# EAGLE design IMU 9DoF Fusion (EAGLE 6.5.0)
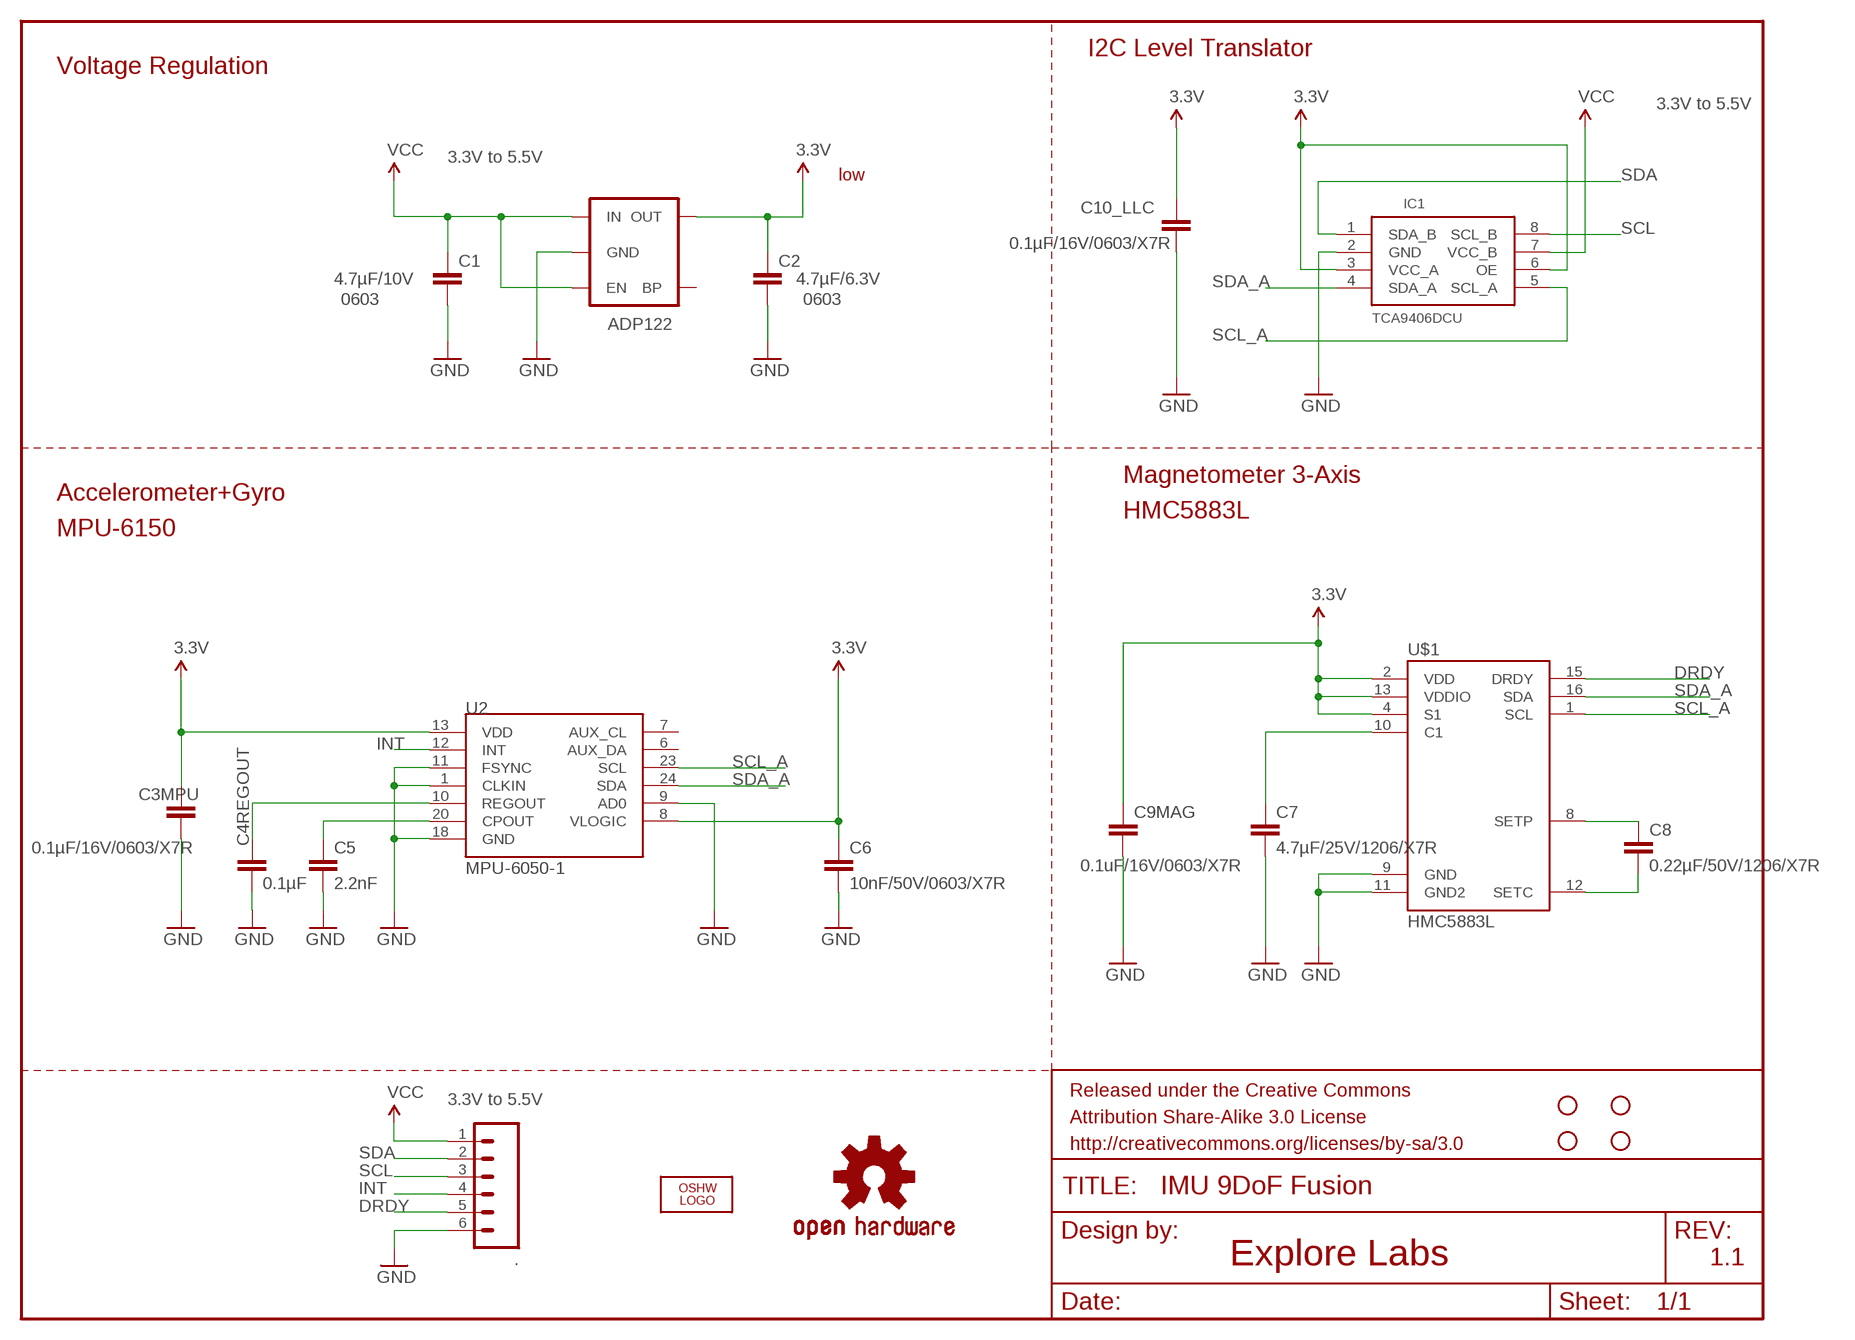
[diagram p0: schematic, sheet 1]

## Parts
.  M06SIP  [1X06]
ADP122  V_REG_LDOSMD  [SOT23-5]
C1  4.7µF/10V  CAP0603-CAP  [0603-CAP]
C2  4.7µF/6.3V  CAP0603-CAP  [0603-CAP]
C3MPU  0.1µF/16V/0603/X7R  CAP0603-CAP  [0603-CAP]
C4REGOUT  0.1µF  CAP0603-CAP  [0603-CAP]
C5  2.2nF  CAP0603-CAP  [0603-CAP]
C6  10nF/50V/0603/X7R  CAP0603-CAP  [0603-CAP]
C7  4.7µF/25V/1206/X7R  CAP1206  [1206]
C8  0.22µF/50V/1206/X7R  CAP1206  [1206]
C9MAG  0.1uF/16V/0603/X7R  CAP0603-CAP  [0603-CAP]
C10_LLC  0.1µF/16V/0603/X7R  CAP0603-CAP  [0603-CAP]
IC1  TCA9406DCU  [VSSOP8]
JP1  STAND-OFFTIGHT  [STAND-OFF-TIGHT]
JP3  STAND-OFFTIGHT  [STAND-OFF-TIGHT]
JP4  STAND-OFFTIGHT  [STAND-OFF-TIGHT]
JP5  STAND-OFFTIGHT  [STAND-OFF-TIGHT]
LOGO1  OSHW_LOGO_FILLX0150-NT  [OSHW_FILLX150_NOTEXT]
U2  MPU-6050-1  [QFN-24-4MM2]
U$1  HMC5883L  [LPCC16]
U$2  OSHW-LOGOS  [OSHW-LOGO-S]

## Nets
3.3V: ADP122.5(OUT) C2.1 C3MPU.1 C6.1 C9MAG.1 C10_LLC.1 IC1.3(VCC_A) IC1.6(OE) U2.8(VLOGIC) U2.13(VDD) U$1.2(VDD) U$1.4(S1) U$1.13(VDDIO)
CPOUT: C5.1 U2.20(CPOUT)
DRDY: ..5 U$1.15(DRDY)
GND: ..6 ADP122.2(GND) C1.2 C2.2 C3MPU.2 C4REGOUT.2 C5.2 C6.2 C7.2 C9MAG.2 C10_LLC.2 IC1.2(GND) U2.1(CLKIN) U2.9(AD0) U2.11(FSYNC) U2.18(GND) U$1.9(GND) U$1.11(GND2)
INT: ..4 U2.12(INT)
N$1: C7.1 U$1.10(C1)
N$4: C8.1 U$1.8(SETP)
N$5: C8.2 U$1.12(SETC)
REGOUT: C4REGOUT.1 U2.10(REGOUT)
SCL: ..3 IC1.8(SCL_B)
SCL_A: IC1.5(SCL_A) U2.23(SCL) U$1.1(SCL)
SDA: ..2 IC1.1(SDA_B)
SDA_A: IC1.4(SDA_A) U2.24(SDA) U$1.16(SDA)
VCC: ..1 ADP122.1(IN) ADP122.3(EN) C1.1 IC1.7(VCC_B)
Unconnected: ADP122.4(BP) U2.6(AUX_DA) U2.7(AUX_CL)

## Notes on the sheet
- I2C Level Translator
- Voltage Regulation
- 3.3V to 5.5V
- 3.3V to 5.5V
- low
- 0603 | 0603
- Magnetometer 3-Axis
- Accelerometer+Gyro
- HMC5883L
- MPU-6150
- 3.3V to 5.5V
- Explore Labs | 1.1

## Library data of the parts
. = SparkFun-Connectors:M06: Header 6 Standard 6-pin 0.1" header. Use with straight break away headers (SKU : PRT-00116), right angle break away headers (PRT-00553), swiss pins (PRT-00743), machine pins (PRT-00117), and female headers (PRT-00115). Molex polarized connector foot print use with SKU : PRT-08094 with associated crimp pins and housings. NOTES ON THE VARIANTS LOCK and LOCK_LONGPADS... This footprint was designed to help hold the alignment of a through-hole component (i.e. 6-pin header) while soldering it into place. You may notice that each hole has been shifted either up or down by 0.005 of an inch from it's more standard position (which is a perfectly straight line). This slight alteration caused the pins (the squares in the middle) to touch the edges of the holes. Because they are alternating, it causes a "brace" to hold the component in place. 0.005 has proven to be the perfect amount of "off-center" position when using our standard breakaway headers. Although looks a little odd when you look at the bare footprint, once you have a header in there, the alteration is very hard to notice. Also, if you push a header all the way into place, it is covered up entirely on the bottom side. This idea of altering the position of holes to aid alignment will be further integrated into the Sparkfun Library for other footprints. It can help hold any component with 3 or more connection pins.
ADP122 = SparkFun-PowerIC:V_REG_LDO: Voltage Regulator LDO Standard 150mA LDO voltage regulator in SOT-23 layout. Micrel part MIC5205. BP (by-pass) pin is used to lower output noise with 470pF cap.
C1 C2 C3MPU C4REGOUT C5-C8 C9MAG C10_LLC = SparkFun-Passives:CAP: Capacitor Standard 0603 ceramic capacitor, and 0.1" leaded capacitor.
IC1 = 11xLabs:TCA9406DCU
JP1 JP3-JP5 = SparkFun-Electromechanical:STAND-OFF: #4 Stand Off This is the mechanical footprint for a #4 phillips button head screw. Use the keepout ring to avoid running the screw head into surrounding components. SKU : PRT-00447
LOGO1 = ohw-logo:OSHW_LOGO_FILL
U2 = Testing:MPU-6050
U$1 = 3DRobotics_edit:HMC5883L: Honeywell HMC5883L 3-axis digital compass IC Successor to the HMC5843.; DATASHEET: http://www.dsscircuits.com/images/datasheets/HMC5883L.pdf; LINK: http://parts.digikey.com/1/parts/2057013-ic-compass-3-axis-i2c-16lcc-smd-hmc5883l-tr.html; MFGPN: HMC5883L-TR
U$2 = SparkFun-Aesthetics:OSHW-LOGO: Open Source Hardware Logo This logo indicates the piece of hardware it is found on incorporates a OSHW license and/or adheres to the definition of open source hardware found here: http://freedomdefined.org/OSHW

## Net classes
0 Default: width 0.203 mm
1 vcc: width 0.254 mm
2 GND: width 0.813 mm

## Board
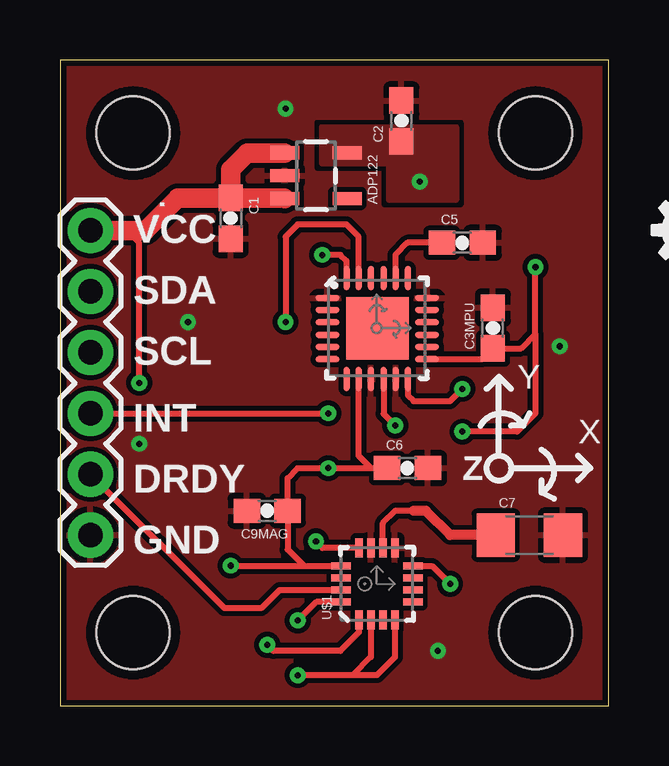
[diagram p1: board, top side]
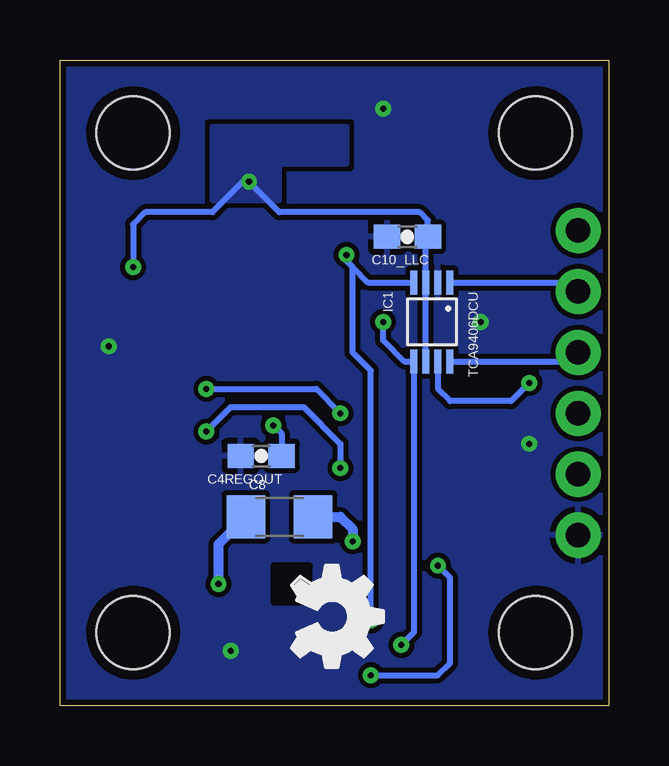
[diagram p2: board, bottom side, seen from below]

Size 22.86 x 26.92 mm. Coordinates in mm from the lower left corner, seen from the top.
Outline: 22.86,0 22.86,26.92 0,26.92 0,0 22.86,0
Copper layers (1*16): Top 0.035mm / dielectric 1.5mm / Bottom 0.035mm
Design rules "default": minimum track width 10mil, minimum drill 10mil, track to track 8mil, track to pad 8mil, pad to pad 8mil, via to via 8mil, smd to smd 8mil, copper to edge 10mil, drill to drill 8mil, minimum pad ring 10mil, minimum via ring 8mil, stop-mask expansion 4mil, vias tented up to drill 18mil, thermal gap 10mil
tKeepout: area 12.4,4.3 to 14,5.8
bKeepout: area 12.4,4.3 to 14,5.8
tRestrict: area 12.4,4.3 to 14,5.8
bRestrict: area 12.4,4.3 to 14,5.8

### Footprints (pad centres in the part's own frame; a part is rotated, then mirrored left to right if it is on the bottom)
1X06 = drill 1.016 pad 1.88: 1 0,0; 2 2.54,0; 3 5.08,0; 4 7.62,0; 5 10.16,0; 6 12.7,0
SOT23-5 = smd 0.55 x 1.2: 1 -0.95,-1.3; 2 0,-1.3; 3 0.95,-1.3; 4 0.95,1.3; 5 -0.95,1.3
0603-CAP = smd 1.1 x 1: 1 -0.85,0; 2 0.85,0
1206 = smd 1.6 x 1.8: 1 -1.4,0; 2 1.4,0
VSSOP8 = smd 1 x 0.3: 1 -1.65,0.75; 2 -1.65,0.25; 3 -1.65,-0.25; 4 -1.65,-0.75; 5 1.65,-0.75; 6 1.65,-0.25; 7 1.65,0.25; 8 1.65,0.75
STAND-OFF-TIGHT = hole 3.048: 0,0
QFN-24-4MM2 = smd 1.016 x 0.254: 1 -2.066,1.257; 2 -2.066,0.75; 3 -2.066,0.247; 4 -2.066,-0.287; 5 -2.066,-0.792; 6 -2.066,-1.297; 13 2.086,-1.297; 14 2.086,-0.792; 15 2.086,-0.287; 16 2.086,0.247; 17 2.086,0.75; 18 2.086,1.257 | smd 0.254 x 1.016: 7 -1.267,-2.122; 8 -0.762,-2.122; 9 -0.258,-2.122; 10 0.278,-2.122; 11 0.78,-2.122; 12 1.287,-2.122; 19 1.287,2.082; 20 0.78,2.082; 21 0.278,2.082; 22 -0.258,2.082; 23 -0.762,2.082; 24 -1.267,2.082 | smd 2.616 x 2.616: P$1 0.02,-0.01
LPCC16 = smd 0.8 x 0.3: 1 -1.5,0.75; 2 -1.5,0.25; 3 -1.5,-0.25; 4 -1.5,-0.75; 9 1.5,-0.75; 10 1.5,-0.25; 11 1.5,0.25; 12 1.5,0.75 | smd 0.3 x 0.8: 5 -0.75,-1.5; 6 -0.25,-1.5; 7 0.25,-1.5; 8 0.75,-1.5; 13 0.75,1.5; 14 0.25,1.5; 15 -0.25,1.5; 16 -0.75,1.5

### Placement (x,y rotation side)
.  1.27,19.81 270 top
ADP122  10.67,22.1 270 top
C1  7.11,20.32 270 top
C2  14.22,24.38 90 top
C3MPU  18.03,15.75 90 top
C4REGOUT  14.48,10.41 180 bottom
C5  16.76,19.3 0 top
C6  14.48,9.91 0 top
C7  19.56,7.11 0 top
C8  13.72,7.87 0 bottom
C9MAG  8.64,8.13 180 top
C10_LLC  8.38,19.56 180 bottom
IC1  7.37,16 270 bottom
JP1  19.81,3.05 90 top
JP3  3.05,23.88 0 top
JP4  19.81,23.88 90 top
JP5  3.05,3.05 0 top
LOGO1  13.21,5.84 270 bottom
U2  13.21,15.75 0 top
U$1  13.21,5.08 90 top
U$2  26.17,19.83 0 top  (outside the outline)
U$3  [EXLABS_LOGO_0.25]  22.1,19.81 270 bottom

### Tracks (layer width: path | path; a pad name or v marks a point on that pad's centre or on a via)
3.3V  (via drill 0.25)
  Top 0.254: 11.7,5.84 U$1.13 10.17,5.83 | U2.8 12.45,10.41 12.95,9.91 C6.1 v11.18,9.91 9.91,9.91 9.49,9.49 C9MAG.1 9.49,6.52 10.17,5.83 | U2.8 | U$1.4 13.96,2.02 13.21,1.27 12.19,1.27 | U$1.2 12.96,2.04 12.19,1.27 | 12.19,1.27 v9.91,1.27 | 19.81,15.49 v19.81,18.29 | 19.81,15.49 19.22,14.9 C3MPU.1 17.59,14.45 U2.13 | v7.11,5.84 7.12,5.83 10.17,5.83 | 19.81,15.49 19.81,12.19 19.05,11.43 v16.76,11.43
  Bottom 0.254: 7.62,17.38 IC1.3 | IC1.6 7.62,14.63 IC1.3 | C10_LLC.1 7.53,20.23 7.87,20.57 13.72,20.57 v14.99,21.84 15.24,21.84 16.51,20.57 19.3,20.57 19.81,20.07 v19.81,18.29 | 7.62,19.22 C10_LLC.1 | v9.91,1.27 7.11,1.27 6.6,1.78 6.6,5.33 v7.11,5.84 | v11.18,9.91 11.18,10.92 12.7,12.45 15.75,12.45 v16.76,11.43 | IC1.3 7.62,19.47 C10_LLC.1
  pour Top (no thermals): 10.92,22.61 10.92,24.13 16.51,24.13 16.51,21.08 13.72,21.08 13.72,22.61
  pour Bottom (no thermals): 10.92,22.61 10.92,24.13 16.51,24.13 16.51,21.08 13.72,21.08 13.72,22.61
CPOUT
  Top 0.254: C5.1 14.48,19.3 13.97,18.8 13.97,17.85 U2.20
DRDY
  Top 0.254: U$1.15 9.15,4.83 8.38,4.06 6.86,4.06 ..5
GND  (via drill 0.25)
  other vias: 20.83,14.99 3.3,10.92 9.4,24.89 5.33,16 15.75,2.29
  pour Top (rank 3): 0,0 0,26.92 22.86,26.92 22.86,0
  pour Bottom (rank 3): 0,0 0,27.43 22.86,27.43 22.86,0
INT  (via drill 0.25)
  Top 0.254: v16.76,13.21 16.26,12.7 14.73,12.7 14.49,12.94 U2.12 | ..4 v11.18,12.19
  Bottom 0.254: v16.76,13.21 12.19,13.21 v11.18,12.19
N$1
  Top 0.254: U$1.10 13.46,7.62 13.97,8.13 14.73,8.13 | 17.9,6.86 C7.1
  Top 0.406: C7.1 16.26,7.11 15.24,8.13 14.73,8.13
N$4  (via drill 0.25)
  Top 0.254: 14.72,5.84 U$1.8 15.51,5.83 v16.26,5.08
  Bottom 0.406: C8.1 16.26,6.73 v16.26,5.08
N$5  (via drill 0.25)
  Top 0.254: U$1.12 10.95,6.58 v10.67,6.86
  Bottom 0.406: C8.2 11.18,7.87 10.67,7.37 v10.67,6.86
REGOUT  (via drill 0.25)
  Top 0.254: U2.10 13.49,12.17 v13.97,11.68
  Bottom 0.254: v13.97,11.68 13.63,11.34 C4REGOUT.1
SCL
  Bottom 0.254: 1.6,14.4 ..3 1.65,14.35 IC1.8
SCL_A  (via drill 0.25)
  Top 0.254: U2.23 | U2.23 12.45,19.56 11.94,20.07 9.91,20.07 9.4,19.56 v9.4,16 | U$1.1 12.46,3.06 11.68,2.29 8.89,2.29 v8.64,2.54
  Bottom 0.254: v9.4,16 9.4,15.24 8.51,14.35 IC1.5 8.12,3.06 v8.64,2.54 8.17,3.01
SDA
  Bottom 0.254: 1.6,17.6 ..2 1.65,17.65 IC1.1
SDA_A  (via drill 0.25)
  Top 0.254: U2.24 11.94,18.54 11.68,18.8 v10.92,18.8 | U$1.16 10.68,4.33 v9.91,3.56
  Bottom 0.254: 10.67,18.29 10.92,18.54 v10.92,18.8 | 10.67,18.29 10.67,14.73 9.91,13.97 v9.91,3.56 | 10.67,18.29 10.03,17.65 IC1.4
VCC  (via drill 0.25)
  Top 0.254: v3.3,13.46 3.3,19.3 2.79,19.81
  Top 0.813: ..1 2.79,19.81 3.56,19.81 4.91,21.17 C1.1 | ADP122.1 7.81,23.05 7.11,22.35 C1.1 | C1.1 9.35,21.17 ADP122.3
  Bottom 0.254: v3.3,13.46 4.06,12.7 6.6,12.7 7.12,13.21 IC1.7

### Text on the board
tNames: VCC | SDA | SCL | INT | DRDY | Z | GND
Reference: Y | X
_tsilk: VCC | SDA | SCL | Y | INT | X | DRDY | Z | GND
_bsilk: VCC | SDA | SCL | INT | DRDY | GND